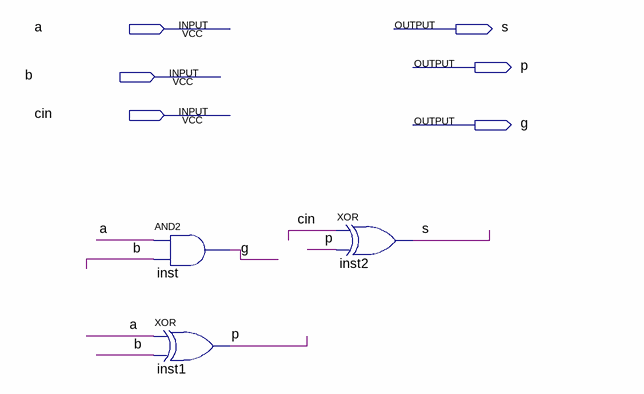
[diagram p0: schematic sheet]
// Quartus schematic cfa.bdf as structural Verilog: 3 symbols, 6 pins
module cfa (
  input  a,
  input  b,
  input  cin,
  output s,
  output p,
  output g
);

  and inst (g, a, b);
  xor inst1 (p, a, b);
  xor inst2 (s, cin, p);
endmodule
